# EAGLE design ns (EAGLE 5.09)
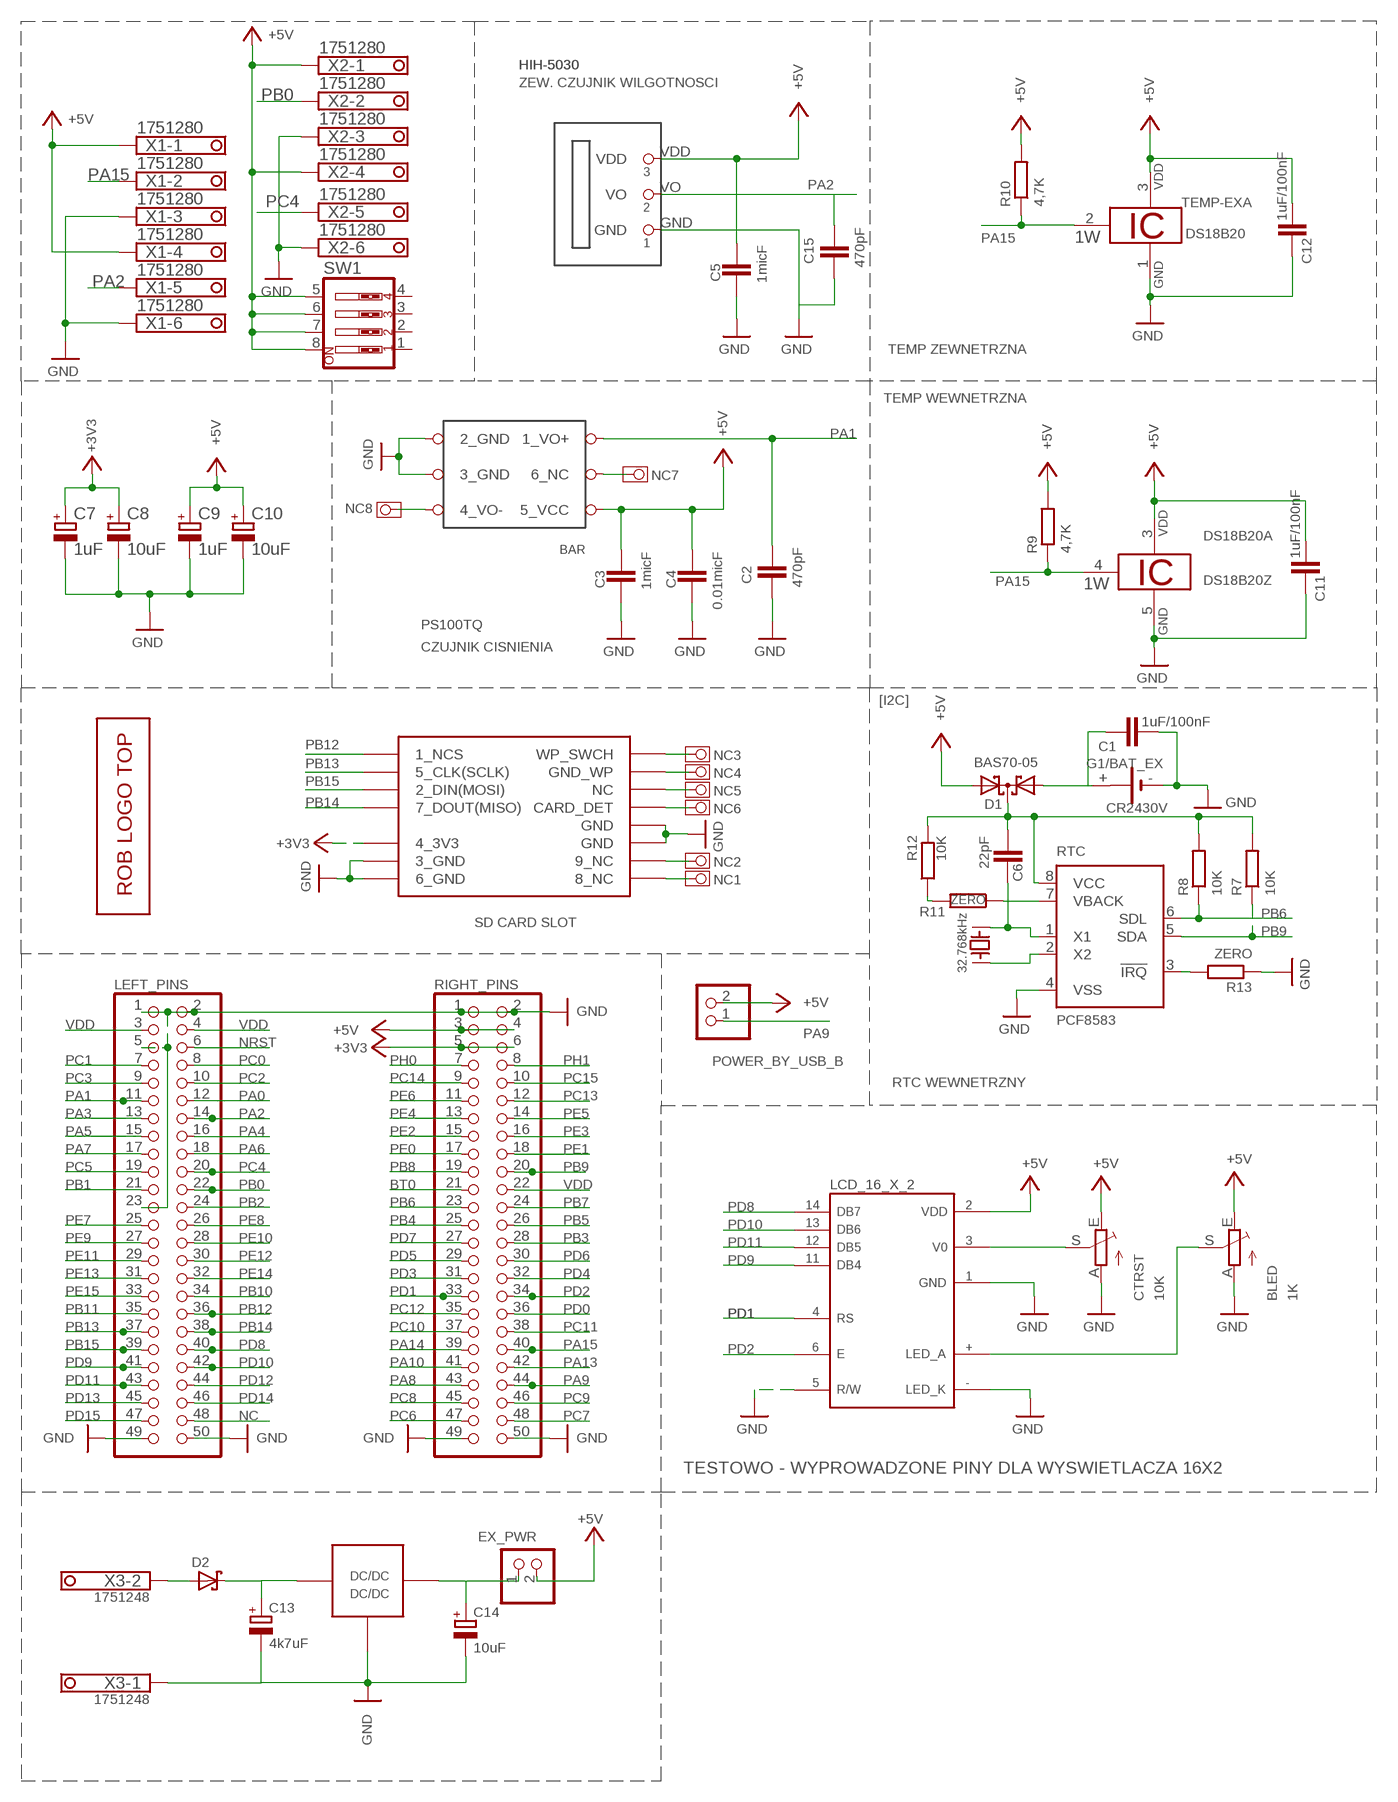
[diagram p0: schematic, sheet 1]

## Parts
BLED  1K  TRIM_EU-B25P  [B25P]
C1  1uF/100nF  C-EUC1206K  [C1206K]
C2  470pF  C-EUC1206K  [C1206K]
C3  1micF  C-EUC1206K  [C1206K]
C4  0.01micF  C-EUC1206K  [C1206K]
C5  1micF  C-EUC1206K  [C1206K]
C6  22pF  C-EUC1206K  [C1206K]
C7  1uF  CPOL-EU153CLV-0505  [153CLV-0505]
C8  10uF  CPOL-EU153CLV-0505  [153CLV-0505]
C9  1uF  CPOL-EU153CLV-0505  [153CLV-0505]
C10  10uF  CPOL-EU153CLV-0505  [153CLV-0505]
C11  1uF/100nF  C-EUC1206K  [C1206K]
C12  1uF/100nF  C-EUC1206K  [C1206K]
C13  4k7uF  CPOL-EU153CLV-0505  [153CLV-0505]
C14  10uF  CPOL-EU153CLV-0505  [153CLV-0505]
C15  470pF  C-EUC1206K  [C1206K]
CTRST  10K  TRIM_EU-B25P  [B25P]
D1  BAS70-05  [SOT23]
D2  MBRS130LT3  [SMB]
DS18B20  DS18B20Z  [SO08]
EX_PWR  PINHD-1X2  [1X02]
G1/BAT_EX  CR2430V  [CR2430V]
LCD_16_X_2  PYC0802A  [PYC0802A-ONLY-PINS]
LEFT_PINS  PINHD-2X25  [2X25]
NC1  SMD_1X1  [SMD_1X1]
NC2  SMD_1X1  [SMD_1X1]
NC3  SMD_1X1  [SMD_1X1]
NC4  SMD_1X1  [SMD_1X1]
NC5  SMD_1X1  [SMD_1X1]
NC6  SMD_1X1  [SMD_1X1]
NC7  SMD_1X1  [SMD_1X1]
NC8  SMD_1X1  [SMD_1X1]
POWER_BY_USB_B  PINHD-1X2  [1X02]
R7  10K  R-EU_M1206  [M1206]
R8  10K  R-EU_M1206  [M1206]
R9  4,7K  R-EU_M1206  [M1206]
R10  4,7K  R-EU_M1206  [M1206]
R11  ZERO  R-EU_R1206  [R1206]
R12  10K  R-EU_R1206  [R1206]
R13  ZERO  R-EU_R1206  [R1206]
RIGHT_PINS  PINHD-2X25  [2X25]
RTC  PCF8583  X1205S8  [SO-08]
SW1  SW_DIP-4  [EDG-04]
TEMP-EX  DS18B20  [TO92-]
U$1  MMC  [MMC_SOCKET]
U$2  XTAL-SMD-MC-146  [XTAL-SMD-MC-146]
U$3  PS100TQ  [PS100TQ]
U$4  HIH5030-CZUJ-WILG  [HIH-5030-CZUJ-WILG]
U$5  ROB-LOGO  [ROB-LOGO-TOP]
U$6  PRZETW-RECOM-R785  [PRZETW-RECOM-R785]
X1  1751280  [1751280]
X2  1751280  [1751280]
X3  1751248  [1751248]

## Nets
32_7_X1: C6.1 RTC.1(X1) U$2.P$3
32_7_X2: RTC.2(X2) U$2.P$1
+3V3: C7.+ C8.+ RIGHT_PINS.5 RIGHT_PINS.6 U$1.4_3V3
+5_RTC: C6.2 D1.3(C) R7.2 R8.2 R12.2 RTC.8(VCC)
+5V: BLED.E C3.2 C4.2 C5.2 C9.+ C10.+ C11.2 C12.2 CTRST.E D1.2(A2) DS18B20.3 EX_PWR.2 LCD_16_X_2.2 POWER_BY_USB_B.2 R9.2 R10.2 RIGHT_PINS.3 RIGHT_PINS.4 SW1.5 SW1.6 SW1.7 SW1.8 TEMP-EX.3 U$3.VCC(5_VCC) U$4.VDD X1.1 X1.4 X2.1 X2.4
BT0: RIGHT_PINS.21
GND: BLED.A C1.2 C2.1 C3.1 C4.1 C5.1 C7.- C8.- C9.- C10.- C11.1 C12.1 C13.- C14.- C15.1 CTRST.A DS18B20.5 G1/BAT_EX.- LCD_16_X_2.1 LCD_16_X_2.5 LCD_16_X_2.LED_K LEFT_PINS.1 LEFT_PINS.2 LEFT_PINS.5 LEFT_PINS.23 LEFT_PINS.49 LEFT_PINS.50 R13.1 RIGHT_PINS.1 RIGHT_PINS.2 RIGHT_PINS.49 RIGHT_PINS.50 RTC.4(VSS) TEMP-EX.1 U$1.3_GND@1(3_GND) U$1.6_GND@2(6_GND) U$1.GND@3(GND) U$1.GND@4(GND) U$3.GND1(2_GND) U$3.GND2(3_GND) U$4.GND U$6.DC_GND X1.3 X1.6 X2.3 X2.6 X3.1
LCD_LED_A: BLED.S LCD_16_X_2.LED_A
LCD_V0: CTRST.S LCD_16_X_2.3
N$1: NC7.P$1 U$3.NC(6_NC)
N$2: NC3.P$1 U$1.WRITE_PROTECTION_SWITCH(WP_SWCH)
N$3: NC8.P$1 U$3.V0-(4_VO-)
N$4: NC4.P$1 U$1.GND@WP(GND_WP)
N$6: NC5.P$1 U$1.NC@3(NC)
N$7: NC6.P$1 U$1.CARD_DETECTION(CARD_DET)
N$8: NC1.P$1 U$1.8_NC@2(8_NC)
N$9: NC2.P$1 U$1.9_NC@1(9_NC)
N$10: C13.+ D2.C U$6.DC_IN
N$11: R11.1 RTC.7(VBACK)
N$12: C1.1 D1.1(A1) G1/BAT_EX.+
N$19: R11.2 R12.1
N$21: C14.+ EX_PWR.1 U$6.DC_OUT
N$22: D2.A X3.2
N$28: R13.2 RTC.3(!IRQ)
NC: LEFT_PINS.48
NRST: LEFT_PINS.6
PA0: LEFT_PINS.12
PA1: C2.2 LEFT_PINS.11 U$3.VO+(1_VO+)
PA2: C15.2 LEFT_PINS.14 U$4.VO X1.5
PA3: LEFT_PINS.13
PA4: LEFT_PINS.16
PA5: LEFT_PINS.15
PA6: LEFT_PINS.18
PA7: LEFT_PINS.17
PA8: RIGHT_PINS.43
PA9: POWER_BY_USB_B.1 RIGHT_PINS.44
PA10: RIGHT_PINS.41
PA13: RIGHT_PINS.42
PA14: RIGHT_PINS.39
PA15: DS18B20.4 R9.1 R10.1 RIGHT_PINS.40 TEMP-EX.2 X1.2
PB0: LEFT_PINS.22 X2.2
PB1: LEFT_PINS.21
PB2: LEFT_PINS.24
PB3: RIGHT_PINS.28
PB4: RIGHT_PINS.25
PB5: RIGHT_PINS.26
PB6: R8.1 RIGHT_PINS.23 RTC.6(SDL)
PB7: RIGHT_PINS.24
PB8: RIGHT_PINS.19
PB9: R7.1 RIGHT_PINS.20 RTC.5(SDA)
PB10: LEFT_PINS.34
PB11: LEFT_PINS.35
PB12: LEFT_PINS.36 U$1.1_NCS
PB13: LEFT_PINS.37 U$1.5_CLK(SCLK)
PB14: LEFT_PINS.38 U$1.7_DOUT(MISO)
PB15: LEFT_PINS.39 U$1.2_DIN(MOSI)
PC0: LEFT_PINS.8
PC1: LEFT_PINS.7
PC2: LEFT_PINS.10
PC3: LEFT_PINS.9
PC4: LEFT_PINS.20 X2.5
PC5: LEFT_PINS.19
PC6: RIGHT_PINS.47
PC7: RIGHT_PINS.48
PC8: RIGHT_PINS.45
PC9: RIGHT_PINS.46
PC10: RIGHT_PINS.37
PC11: RIGHT_PINS.38
PC12: RIGHT_PINS.35
PC13: RIGHT_PINS.12
PC14: RIGHT_PINS.9
PC15: RIGHT_PINS.10
PD0: RIGHT_PINS.36
PD1: LCD_16_X_2.4 RIGHT_PINS.33
PD2: LCD_16_X_2.6 RIGHT_PINS.34
PD3: RIGHT_PINS.31
PD4: RIGHT_PINS.32
PD5: RIGHT_PINS.29
PD6: RIGHT_PINS.30
PD7: RIGHT_PINS.27
PD8: LCD_16_X_2.14 LEFT_PINS.40
PD9: LCD_16_X_2.11 LEFT_PINS.41
PD10: LCD_16_X_2.13 LEFT_PINS.42
PD11: LCD_16_X_2.12 LEFT_PINS.43
PD12: LEFT_PINS.44
PD13: LEFT_PINS.45
PD14: LEFT_PINS.46
PD15: LEFT_PINS.47
PE0: RIGHT_PINS.17
PE1: RIGHT_PINS.18
PE2: RIGHT_PINS.15
PE3: RIGHT_PINS.16
PE4: RIGHT_PINS.13
PE5: RIGHT_PINS.14
PE6: RIGHT_PINS.11
PE7: LEFT_PINS.25
PE8: LEFT_PINS.26
PE9: LEFT_PINS.27
PE10: LEFT_PINS.28
PE11: LEFT_PINS.29
PE12: LEFT_PINS.30
PE13: LEFT_PINS.31
PE14: LEFT_PINS.32
PE15: LEFT_PINS.33
PH0: RIGHT_PINS.7
PH1: RIGHT_PINS.8
VDD: LEFT_PINS.3 LEFT_PINS.4 RIGHT_PINS.22
Unconnected: G1/BAT_EX.+@1(+) SW1.1 SW1.2 SW1.3 SW1.4

## Notes on the sheet
- HIH-5030 | HIH-5030
- ZEW. CZUJNIK WILGOTNOSCI
- TEMP ZEWNETRZNA
- TEMP WEWNETRZNA
- PS100TQ
- CZUJNIK CISNIENIA
- [I2C]
- SD CARD SLOT
- RTC WEWNETRZNY
- TESTOWO - WYPROWADZONE PINY DLA WYSWIETLACZA 16X2

## Library data of the parts
BLED CTRST = pot:TRIM_EU-: POTENTIOMETER
C1-C6 C11 C12 C15 = rcl:C-EU: CAPACITOR, European symbol
C7-C10 C13 C14 = rcl:CPOL-EU: POLARIZED CAPACITOR, European symbol
D1 = diode:BAS70-05: Silicon Schottky Diodes General-purpose diode for high-speed switching
D2 = diode:MBRS130LT3: Schottky Power Rectifier Source: http://www.onsemi.com/pub/Collateral/MBRS130LT3-D.PDF
DS18B20 TEMP-EX = ds18b20:DS18B20: Programmable Resolution Digital Thermometer This chip provides a onewire thermosensor with approx. 0.5°C accuracy. A programmable over/undertemperure alarm is available. The precision can be set from 9..12 bits. Notes: Vdd must be applied for accurate measurements at low temperatures, as the parasite power circuit otherwise heats the sensor. If parasite power is used, Vdd has to be connected to GND. The DS1822 is a low-cost thermometer chip, the DS18S20 is similar to the DS18B20, but with 9 Bit precision only. Author: Jan Kandziora <jjj@gmx.de>
EX_PWR POWER_BY_USB_B = pinhead:PINHD-1X2: PIN HEADER
G1/BAT_EX = battery:CR2430V: LI BATTERY Varta
LCD_16_X_2 = PYC0802:PYC0802A
LEFT_PINS RIGHT_PINS = pinhead:PINHD-2X25: PIN HEADER
NC1-NC8 = pinhead:SMD_1X1
R7-R13 = rcl:R-EU_: RESISTOR, European symbol
RTC = xicor:X1205*: 2-Wire RTC Real Time Clock/Calendar
SW1 = special:SW_DIP-4: DIP SWITCH
U$1 = SD:MMC
U$2 = rob:XTAL-SMD-MC-146
U$3 = rob:PS100TQ
U$4 = rob:HIH5030-CZUJ-WILG
U$5 = rob:ROB-LOGO
U$6 = rob:PRZETW-RECOM-R785
X1 X2 = con-phoenix-350:1751280: MKDS 1/ 6-3,5 Printklemme Nennstrom: 10 A Bemessungsspannung: 160 V Raster: 3,5 mm Polzahl: 6 Montageart: Löten Anschlussart: Schraubanschluss Anschlussrichtung vom Leiter zur Platine: 0° Source: http://eshop.phoenixcontact.com .. 1751280.pdf
X3 = con-phoenix-350:1751248: MKDS 1/ 2-3,5 Printklemme Nennstrom: 10 A Bemessungsspannung: 160 V Raster: 3,5 mm Polzahl: 2 Montageart: Löten Anschlussart: Schraubanschluss Anschlussrichtung vom Leiter zur Platine: 0° Source: http://eshop.phoenixcontact.com .. 1751248.pdf

## Board
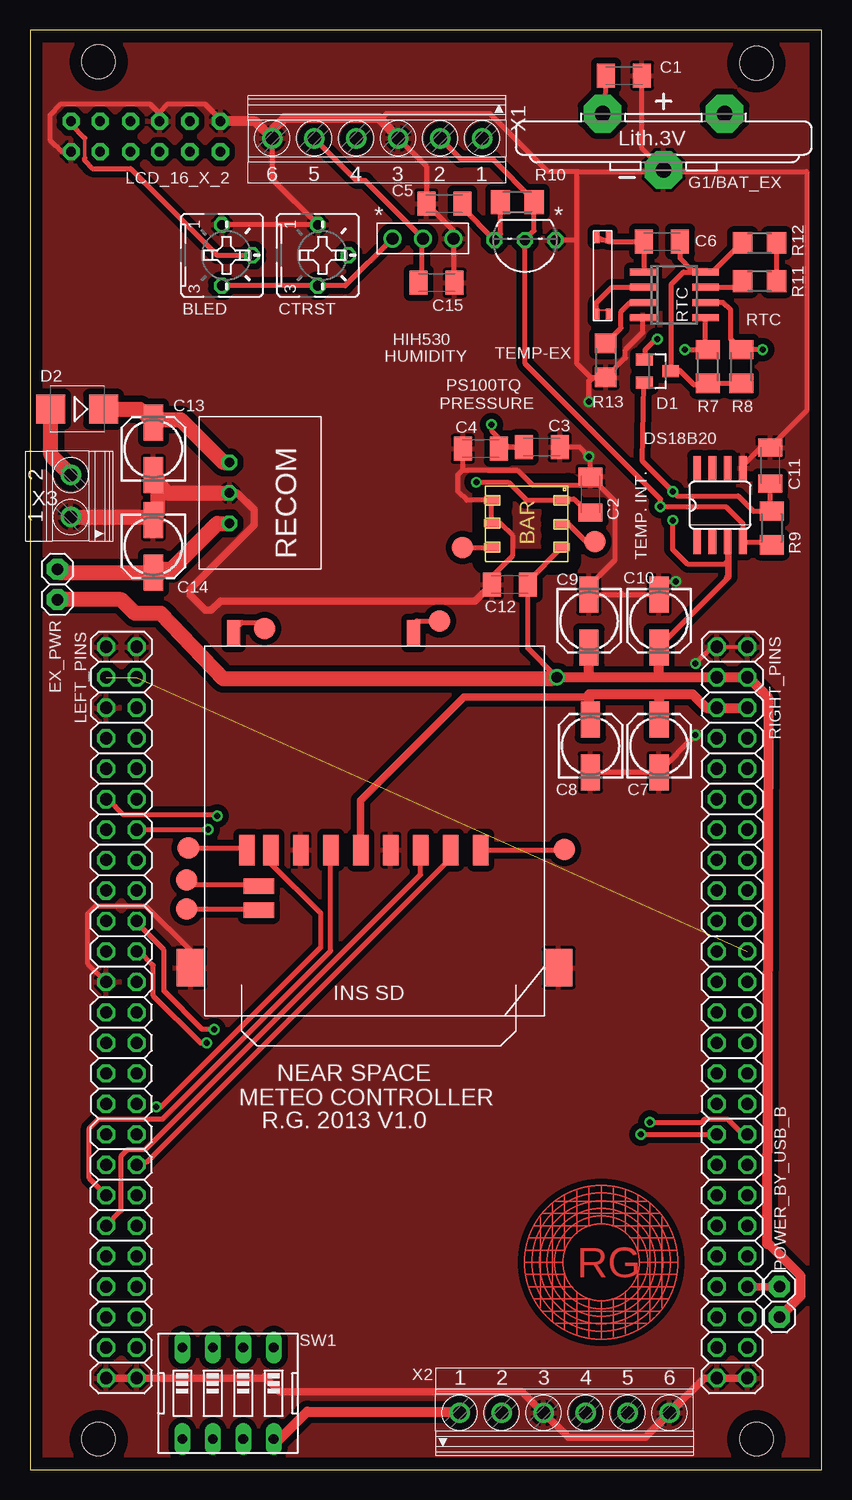
[diagram p1: board, top side]
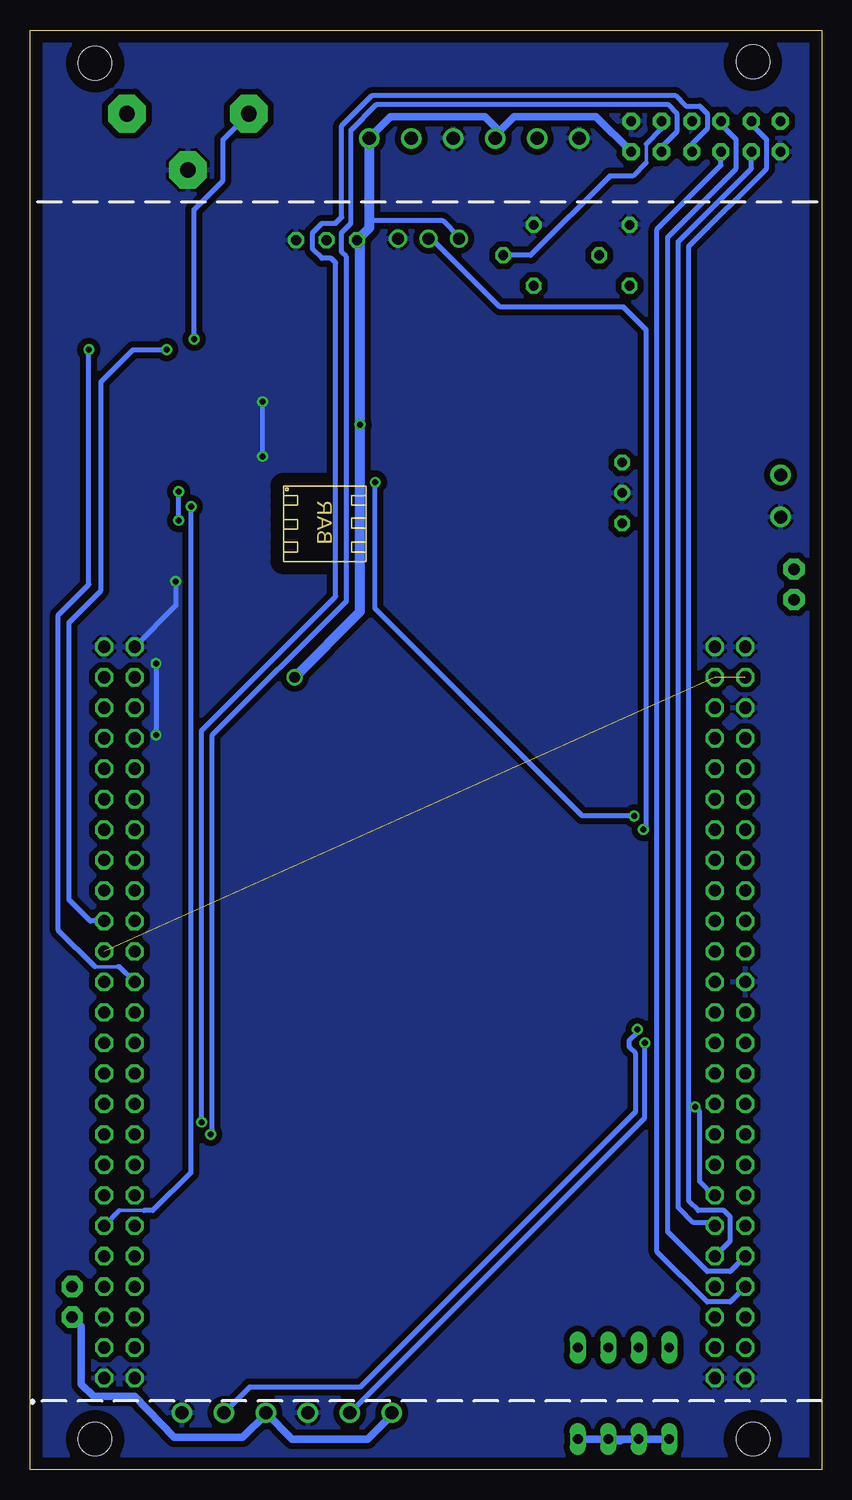
[diagram p2: board, bottom side, seen from below]

Size 66 x 120 mm. Coordinates in mm from the lower left corner, seen from the top.
Outline: 0,0 66,0 66,120 0,120 0,0
Copper layers (1*16): Top 0.035mm / dielectric 1.5mm / Bottom 0.035mm
Design rules "default *": minimum track width 10mil, minimum drill 24mil, track to track 20mil, track to pad 20mil, pad to pad 20mil, via to via 20mil, smd to smd 20mil, copper to edge 40mil, drill to drill 20mil, minimum pad ring 10mil, minimum via ring 8mil, stop-mask expansion 4mil, vias tented up to drill 0mil, thermal gap 10mil
Holes 2.8 mm at 5.71,117.35 60.58,117.22 60.58,2.54 5.71,2.54

### Footprints (pad centres in the part's own frame; a part is rotated, then mirrored left to right if it is on the bottom)
B25P = drill 0.813 octagon: A -2.54,0; E 2.54,0; S 0,2.54
C1206K = smd 1.5 x 2: 1 -1.5,0; 2 1.5,0
153CLV-0505 = smd 3 x 1.6: + 2.2,0; - -2.2,0
SOT23 = smd 1 x 1.4: 1 -0.95,-1.1; 2 0.95,-1.1; 3 0,1.1
SMB = smd 2.4 x 2.4: A 2.2,0; C -2.2,0
SO08 = smd 0.66 x 2.032: 1 -1.905,-3.073; 2 -0.635,-3.073; 3 0.635,-3.073; 4 1.905,-3.073; 5 1.905,3.073; 6 0.635,3.073; 7 -0.635,3.073; 8 -1.905,3.073
1X02 = drill 0.965 pad 1.778 octagon: 1 -1.27,0; 2 1.27,0
CR2430V = drill 1.321 pad 3.15 octagon: + -2.54,-5.08; +@1 -2.54,5.08; - 2.159,0
PYC0802A-ONLY-PINS = drill 0.8 pad 1.422 octagon: 1 2.54,0; 2 0,0; 3 2.54,2.54; 4 0,2.54; 5 2.54,5.08; 6 0,5.08; 11 2.54,7.493; 12 0,7.493; 13 2.54,10.033; 14 0,10.033; LED_A 2.54,12.446; LED_K 0,12.446
2X25 = drill 1.016 octagon: 1 -30.48,-1.27; 2 -30.48,1.27; 3 -27.94,-1.27; 4 -27.94,1.27; 5 -25.4,-1.27; 6 -25.4,1.27; 7 -22.86,-1.27; 8 -22.86,1.27; 9 -20.32,-1.27; 10 -20.32,1.27; 11 -17.78,-1.27; 12 -17.78,1.27; 13 -15.24,-1.27; 14 -15.24,1.27; 15 -12.7,-1.27; 16 -12.7,1.27; 17 -10.16,-1.27; 18 -10.16,1.27; 19 -7.62,-1.27; 20 -7.62,1.27; 21 -5.08,-1.27; 22 -5.08,1.27; 23 -2.54,-1.27; 24 -2.54,1.27; 25 0,-1.27; 26 0,1.27; 27 2.54,-1.27; 28 2.54,1.27; 29 5.08,-1.27; 30 5.08,1.27; 31 7.62,-1.27; 32 7.62,1.27; 33 10.16,-1.27; 34 10.16,1.27; 35 12.7,-1.27; 36 12.7,1.27; 37 15.24,-1.27; 38 15.24,1.27; 39 17.78,-1.27; 40 17.78,1.27; 41 20.32,-1.27; 42 20.32,1.27; 43 22.86,-1.27; 44 22.86,1.27; 45 25.4,-1.27; 46 25.4,1.27; 47 27.94,-1.27; 48 27.94,1.27; 49 30.48,-1.27; 50 30.48,1.27
SMD_1X1 = smd 1.778 x 1.778: P$1 0,0
M1206 = smd 1.6 x 2: 1 -1.4,0; 2 1.4,0
R1206 = smd 1.6 x 1.803: 1 -1.422,0; 2 1.422,0
SO-08 = smd 0.6 x 2.2: 1 -1.905,-2.6; 2 -0.635,-2.6; 3 0.635,-2.6; 4 1.905,-2.6; 5 1.905,2.6; 6 0.635,2.6; 7 -0.635,2.6; 8 -1.905,2.6
EDG-04 = drill 0.813 long: 1 -3.81,-3.81; 2 -1.27,-3.81; 3 1.27,-3.81; 4 3.81,-3.81; 5 3.81,3.81; 6 1.27,3.81; 7 -1.27,3.81; 8 -3.81,3.81
TO92- = drill 0.813 octagon: 1 -2.54,0; 2 0,0; 3 2.54,0
MMC_SOCKET = smd 1.27 x 2.54: 1_NCS 7.27,-2.73; 2_DIN(MOSI) 4.77,-2.73; 3_GND@1 2.27,-2.73; 4_3V3 -0.23,-2.73; 5_CLK(SCLK) -2.73,-2.73; 6_GND@2 -5.23,-2.73; 7_DOUT(MISO) -7.73,-2.73; 8_NC@2 -9.73,-2.73; 9_NC@1 9.77,-2.73 | smd 1.067 x 2.184: CARD_DETECTION -10.83,15.37; NC@3 4.17,15.37 | smd 2.3 x 3.1: GND@3 -14.43,-12.53; GND@4 16.27,-12.53 | smd 2.54 x 1.27: GND@WP -8.73,-5.73; WRITE_PROTECTION_SWITCH -8.73,-7.73
XTAL-SMD-MC-146 = smd 1.016 x 0.508: P$1 0.508,1.27; P$2 0.508,0.254; P$3 6.985,1.27; P$4 6.985,0.254
PS100TQ = smd 1.27 x 0.66: GND1 0.5,5.1; GND2 0.5,3.2; NC 6.4,3.1; V0- 0.5,1.2; VCC 6.4,1.2; VO+ 6.4,5.1
HIH-5030-CZUJ-WILG = drill 1 pad 1.27 round: GND 1.27,0; VDD -3.81,0; VO -1.27,0
PRZETW-RECOM-R785 = drill 0.8 octagon: DC_GND 2.54,0; DC_IN 0,0; DC_OUT 5.08,0
1751280 = drill 1.1 pad 1.7 round: 1 -8.75,-0.1; 2 -5.25,-0.1; 3 -1.75,-0.1; 4 1.75,-0.1; 5 5.25,-0.1; 6 8.75,-0.1
1751248 = drill 1.1 pad 1.7 round: 1 -1.75,-0.1; 2 1.75,-0.1

### Placement (x,y rotation side)
BLED  16,101.22 270 top
C1  49.53,116.2 0 top
C2  46.74,81.28 270 top
C3  42.67,85.22 180 top
C4  37.59,85.09 0 top
C5  34.54,105.54 0 top
C6  52.7,102.36 0 top
C7  52.45,60.33 90 top
C8  46.74,60.33 90 top
C9  46.61,70.74 270 top
C10  52.45,70.74 270 top
C11  61.72,83.69 270 top
C12  40.01,73.79 0 top
C13  10.29,85.09 90 top
C14  10.29,76.96 270 top
C15  33.91,98.93 180 top
CTRST  24,101.22 270 top
D1  52.32,91.57 270 top
D2  3.94,88.39 180 top
DS18B20  57.53,80.39 0 top
EX_PWR  2.29,73.79 270 top
G1/BAT_EX  52.83,110.49 270 top
LCD_16_X_2  15.88,109.86 90 top
LEFT_PINS  7.62,38.1 270 top
NC1  13.21,51.82 0 top
NC2  44.58,51.69 0 top
NC3  13.08,46.74 0 top
NC4  13.08,49.15 0 top
NC5  34.16,70.74 0 top
NC6  19.56,70.1 0 top
NC7  47.12,77.34 0 top
NC8  36.07,76.83 0 top
POWER_BY_USB_B  62.48,13.97 270 top
R7  56.52,91.95 270 top
R8  59.31,91.95 270 top
R9  61.85,78.49 90 top
R10  40.64,105.66 180 top
R11  60.83,99.06 0 top
R12  60.83,102.23 180 top
R13  48.01,92.46 90 top
RIGHT_PINS  58.55,38.1 270 top
RTC  53.72,97.92 270 top
SW1  16.51,6.35 180 top
TEMP-EX  41.27,102.49 180 top
U$1  27.81,54.36 0 top
U$2  48.51,95.76 90 top
U$3  37.97,75.69 0 top
U$4  34.04,102.62 0 top
U$5  47.62,17.27 0 top
U$6  16.64,83.95 270 top
X1  28.96,110.87 180 top
X2  44.58,4.83 0 top
X3  3.3,81.15 90 top

### Tracks (layer width: path | path; a pad name or v marks a point on that pad's centre or on a via)
32_7_X1
  Top 0.406: RTC.1 51.2,99.91 C6.1 48.26,102.36 U$2.P$3
32_7_X2
  Top 0.406: RTC.2 48.51,98.55 47.24,97.28 U$2.P$1
+3V3
  Top 0.61: U$1.4_3V3 27.58,55.78 36.2,64.39 46.35,64.39 46.61,64.64
  Top 0.813: RIGHT_PINS.6 RIGHT_PINS.5 56.39,63.5 55.24,64.64 52.45,64.64 | 52.45,64.64 C7.+ | 52.45,64.64 46.61,64.64 46.61,62.65 C8.+
+5_RTC
  Top 0.406: RTC.8 56.52,99.82 | R12.2 59.31,102.23 57.02,99.95 56.45,99.95 | RTC.8 56.45,99.95 | 56.45,99.95 55.24,99.95 54.23,100.97 54.23,102.34 C6.2 | RTC.8 54.48,99.82 53.47,98.81 53.47,91.61 | 53.47,91.61 D1.3 | 53.47,91.61 54.19,91.61 55.37,90.42 56.39,90.42 R7.2 R8.2
+5V  (via drill 0.5 pad 0.41, 0.9 pad 0.41)
  Top 0.406: R10.2 39.24,102.99 TEMP-EX.3 36.04,105.18 C5.2 | v43.94,66.04 41.51,68.48 C12.2 41.51,74.02 U$3.VCC | C11.2 61.72,80.01 R9.2 60.32,79.89 59.05,81.15 53.98,81.15 v53.59,81.53 53.53,81.6 53.47,81.66 51.05,84.07 51.18,90.57 | 51.18,90.57 51.05,90.45 | C10.+ 52.45,68.58 58.29,74.42 58.29,77.19 DS18B20.3 58.17,75.69 | 51.18,90.57 D1.2 | 58.17,75.69 58.17,74.42 58.04,74.3 | v53.59,79.12 53.59,76.71 54.86,75.44 57.91,75.44 58.17,75.69 | BLED.E CTRST.E 26.29,98.68 U$4.VDD | C4.2 39.22,85.22 C3.2 39.88,85.22 38.48,86.61 v38.48,87.12
  Top 0.813: 46.86,66.04 v43.94,66.04 | 52.45,66.04 46.86,66.04 | 52.45,66.04 RIGHT_PINS.3 RIGHT_PINS.4 59.94,66.04 61.59,64.26 61.47,18.8 61.59,18.8 64.26,16.13 64.26,14.48 POWER_BY_USB_B.2 | 52.45,66.04 C10.+ | C9.+ 46.61,66.29 46.86,66.04 | SW1.8 20.83,2.54 23.11,4.83 35.73,4.83 X2.1
  Top 1.27: EX_PWR.2 7.62,72.52 8.76,71.37 10.92,71.37 16.13,65.91 43.43,65.91 v43.94,66.04
  Bottom 0.406: v53.59,79.12 v53.59,81.53 | U$4.VDD 30.23,102.74 31.62,104.14 37.58,104.14 37.71,103.76
  Bottom 0.61: 37.71,111.01 35.94,112.78 28.07,112.78 27.18,111.89 27.18,111 | X1.4 27.21,111.22 25.65,112.78 18.8,112.78 LCD_16_X_2.2 | X2.1 35.83,4.56 37.85,2.54 44.14,2.54 X2.4 46.33,4.6 48.26,2.67 53.98,2.67 57.28,6.1 60.71,6.1 61.72,7.11 61.72,11.94 POWER_BY_USB_B.2 | SW1.7 SW1.8 | SW1.7 16.89,2.54 16.76,2.41 17.65,2.41 SW1.7 | SW1.7 SW1.6 SW1.5
  Bottom 0.813: v43.94,66.04 38.48,71.5 v38.48,87.12 38.48,101.98 38.73,102.11 TEMP-EX.3 37.71,103.52 37.71,103.76 X1.1 37.71,111.01 | 27.18,111 X1.4
GND  (via drill 0.5 pad 0.41)
  Top 0.305: RIGHT_PINS.1 RIGHT_PINS.2 | 52.92,72.94 52.92,73.83 52.7,74.04
  Top 0.406: C1.2 51.03,110.13 G1/BAT_EX.- 52.96,108.2 | DS18B20.5 59.46,83.46 59.46,83.72 61.09,85.34 61.57,85.34 C11.1 61.47,85.45 61.47,85.47 61.98,85.47 64.77,88.27 64.77,108.2 52.96,108.2 | 45.72,108.2 52.96,108.2 | RTC.4 51.12,94.81 49.66,93.34 49.66,92.69 R13.1 46.97,91.03 | 46.97,91.03 46.76,91.03 45.59,92.2 45.59,102.36 | 45.59,102.36 45.59,102.49 | 45.59,102.36 45.47,102.49 TEMP-EX.1 45.59,102.49 | 52.92,72.94 C10.- 49.4,72.94 | 49.4,72.94 C9.- 46.61,73.66 48.77,75.82 48.77,80.75 C2.1 | C12.1 38.51,74.45 40.26,76.2 40.26,77.85 39.24,78.87 38.5,78.87 U$3.GND2 U$3.GND1 36.43,80.79 35.69,81.53 35.69,82.93 36.07,83.31 | 49.4,72.94 49.28,73.07 | C8.- C7.- 52.45,58.17 v55.5,61.21 | 36.07,83.31 40.64,83.31 41.91,82.04 47.4,82.04 C2.1 | 52.7,74.04 v53.85,74.04 | C2.1 46.74,84.45 v46.61,84.45 45.85,85.22 C3.1 | v46.61,89 46.61,90.68 | 46.61,90.68 46.61,90.81 | 46.61,90.68 46.97,91.03 | RIGHT_PINS.1 56.9,68.58 v55.5,67.18 | X1.3 33.04,108.63 C5.1 35.31,103.28 U$4.GND 35.31,99.04 C15.1 | 45.59,102.49 45.59,108.08 45.72,108.2 | 45.72,108.2 43.18,108.2 38.35,113.03 29.72,113.03 29.21,112.52 | LCD_16_X_2.1 15.88,112.52 14.61,113.79 11.43,113.79 10.79,113.16 LCD_16_X_2.5 10.79,113.03 10.03,113.79 2.54,113.79 1.65,112.9 1.65,110.87 2.67,109.86 LCD_16_X_2.LED_K | X1.6 20.21,107.56 CTRST.A BLED.A | LEFT_PINS.49 19.43,7.62 19.56,7.75 | C4.1 36.09,83.34 36.07,83.31 | U$1.GND@3 13.38,43.26 9.65,46.99 5.46,46.99 4.83,46.35 4.83,42.16 LEFT_PINS.23
  Top 0.61: RIGHT_PINS.50 RIGHT_PINS.49 56.22,7.62 X2.6 53.33,4.69 51.31,2.67 44.89,2.67 X2.3 42.83,4.67 | U$6.DC_GND 17.27,81.41 18.67,80.01 18.67,78.74 13.34,73.41 13.34,72.9 14.61,71.63 15.11,71.63 15.88,72.39 37.11,72.39 C12.1 | C14.- 10.29,79.38 10.31,79.4 | 19.56,7.62 LEFT_PINS.50 LEFT_PINS.49 | 42.83,4.67 42.83,4.47 | 42.83,4.67 41.02,6.48 20.83,6.48 19.56,7.75
  Top 0.813: X1.3 30.71,111.03 29.21,112.52 29.08,112.65 21.21,112.65 20.19,111.63 20.19,110.98 X1.6 18.78,112.39 LCD_16_X_2.1
  Top 1.27: X3.1 10.31,79.4 10.67,79.76 10.67,82.17 | 10.67,82.17 10.67,82.51 C13.- | U$6.DC_GND 11.43,81.41 10.67,82.17
  Bottom 0.406: v53.85,74.04 53.85,72.01 RIGHT_PINS.1 | v46.61,84.45 v46.61,89 | v55.5,67.18 v55.5,61.21
  pour Top: -0.13,-0.13 66.04,-0.13 66.04,119.89 65.91,120.02 -0.13,120.02
  pour Bottom: 0,120.02 0,0 66.04,0 66.04,120.02
LCD_LED_A
  Top 0.305: 4.57,109.35 4.57,111
  Top 0.406: LCD_16_X_2.LED_A 3.43,112.14 4.57,111 | 4.57,109.35 4.57,109.09 5.21,108.46 8.38,108.46 15.62,101.22 BLED.S
LCD_V0
  Bottom 0.305: 14.61,108.97 14.61,110.49
  Bottom 0.406: LCD_16_X_2.3 13.34,111.76 14.61,110.49 | 14.61,108.97 15.75,107.82 17.65,107.82 24.26,101.22 CTRST.S
N$1
  Top 0.406: U$3.NC 44.91,78.79 46.61,77.09 NC7.P$1
N$2
  Top 0.406: NC3.P$1 18.97,46.74 U$1.WRITE_PROTECTION_SWITCH
N$3
  Top 0.406: NC8.P$1 38.42,76.83 U$3.V0-
N$4
  Top 0.406: NC4.P$1 13.46,49.15 13.84,48.77 18.94,48.77 U$1.GND@WP
N$6
  Top 0.406: NC5.P$1 32.26,70.74 31.88,70.36 31.88,69.83 U$1.NC@3
N$7
  Top 0.406: U$1.CARD_DETECTION 16.98,69.94 17.65,70.61 19.05,70.61 NC6.P$1
N$8
  Top 0.406: NC1.P$1 17.89,51.82 U$1.8_NC@2
N$9
  Top 0.406: U$1.9_NC@1 44.51,51.63 NC2.P$1
N$10
  Top 1.27: U$6.DC_IN 16.13,83.95 12.57,87.5 10.5,87.5 C13.+ 9.19,88.39 D2.C
N$11
  Top 0.406: RTC.7 58.9,98.55 R11.1
N$12  (via drill 0.5 pad 0.41)
  Top 0.406: C1.1 47.98,113.26 G1/BAT_EX.+ | D1.1 51.22,92.54 51.31,92.71 51.31,93.34 52.2,94.23 v52.32,94.23
  Bottom 0.406: v52.32,94.23 52.32,105.03 49.91,107.44 49.91,110.87 G1/BAT_EX.+
N$19
  Top 0.406: R11.2 R12.1
N$21
  Top 1.27: U$6.DC_OUT 15.62,78.87 11.81,75.06 10.58,75.06 C14.+ 2.58,74.76 EX_PWR.1
N$22
  Top 1.27: D2.A 1.74,84.57 X3.2
N$28
  Top 0.406: RTC.3 50.04,97.28 49.28,96.52 49.28,95.15 R13.2
PA1  (via drill 0.5 pad 0.41)
  Top 0.406: C2.2 46.46,79.78 45.34,80.9 44.48,80.9 U$3.VO+ 41.38,80.79 39.88,82.3 v37.21,82.3 | LEFT_PINS.11 6.48,55.88 7.75,54.61 15.49,54.61 v15.62,54.48
  Bottom 0.406: v37.21,82.3 37.21,71.75 19.94,54.48 v15.62,54.48
PA2  (via drill 0.5 pad 0.41)
  Top 0.406: X1.5 27.23,107.44 27.94,107.44 U$4.VO 32.66,102.26 32.64,99.57 32.64,99.69 32.41,99.34 C15.2 | LEFT_PINS.14 v14.86,53.34
  Bottom 0.406: U$4.VO 32.51,102.62 26.8,96.9 16.51,96.9 14.61,95 14.61,53.47 v14.86,53.34
PA9
  Top 0.61: RIGHT_PINS.44 POWER_BY_USB_B.1
PA15  (via drill 0.5 pad 0.41)
  Top 0.406: R9.1 61.62,77.32 DS18B20.4 59.44,78.87 58.04,80.26 v52.58,80.26 52.58,80.9 52.45,81.03 41.27,92.2 TEMP-EX.2 42.04,103.25 R10.1 42.04,105.79 38.61,109.22 35.96,109.22 X1.2
  Bottom 0.305: 56.52,21.59 58.55,21.59
  Bottom 0.406: 58.55,21.59 RIGHT_PINS.40 | 56.52,21.59 55.75,21.59 52.58,24.77 v52.58,80.26
PB0  (via drill 0.5 pad 0.41)
  Top 0.406: LEFT_PINS.22 9.14,43.18 10.29,42.04 10.29,39.5 14.22,35.56 v14.73,35.56
  Bottom 0.406: v14.73,35.56 14.73,29.32 X2.2
PB6  (via drill 0.5 pad 0.41)
  Top 0.406: RTC.6 57.78,97.28 58.42,96.65 58.42,94.24 R8.1 v61.08,93.35 v61.09,93.34
  Bottom 0.305: 58.67,41.91 60.58,41.91
  Bottom 0.406: v61.09,93.34 61.09,73.79 63.63,71.25 63.63,44.96 60.58,41.91 | 58.67,41.91 58.55,41.91 RIGHT_PINS.23
PB9  (via drill 0.5 pad 0.41)
  Top 0.406: RTC.5 56.32,93.54 R7.1 54.49,93.35 v54.61,93.34
  Bottom 0.406: 54.61,93.47 v54.61,93.34 57.4,93.34 60.07,90.68 60.07,73.28 62.74,70.61 62.74,47.5 60.96,45.72 RIGHT_PINS.20
PB12
  Top 0.406: U$1.1_NCS 35.08,50.96 9.78,25.65 9.14,25.65 LEFT_PINS.36
PB13
  Top 0.406: U$1.5_CLK(SCLK) 25.08,43.24 11.05,29.21 5.71,29.21 4.95,28.45 4.95,24.26 LEFT_PINS.37
PB14  (via drill 0.5 pad 0.41)
  Top 0.406: U$1.7_DOUT(MISO) 20.08,50.53 24.26,46.35 24.26,43.56 10.92,30.23 v10.54,30.23
  Bottom 0.406: LEFT_PINS.38 9.02,22.86 10.16,24 10.16,29.84 v10.54,30.23
PB15
  Top 0.406: U$1.2_DIN(MOSI) 32.58,49.6 9.65,26.67 8.13,26.67 7.62,26.16 7.62,21.59 LEFT_PINS.39
PC4  (via drill 0.5 pad 0.41)
  Top 0.406: LEFT_PINS.20 8.89,45.59 11.18,43.31 11.18,39.88 14.35,36.7 v15.37,36.7
  Bottom 0.406: v15.37,36.7 15.37,36.45 16,35.81 16,35.18 15.49,34.67 15.49,29.84 38.48,6.86 47.7,6.86 X2.5
PD1  (via drill 0.5 pad 0.41)
  Top 0.406: v50.93,27.94 RIGHT_PINS.33
  Bottom 0.406: LCD_16_X_2.4 13.34,110.24 12.06,111.51 12.06,113.03 12.83,113.79 37.08,113.79 39.24,111.63 39.24,103.89 40.01,103.12 40.01,101.47 39.62,101.09 39.62,72.39 50.8,61.21 50.8,28.07 v50.93,27.94
PD2  (via drill 0.5 pad 0.41)
  Top 0.406: RIGHT_PINS.34 59.44,27.94 58.17,29.21 56.26,29.21 56.01,28.96 v51.69,28.96
  Bottom 0.406: LCD_16_X_2.6 10.79,110.49 9.53,111.76 9.53,113.03 10.16,113.67 11.3,113.67 12.19,114.55 37.47,114.55 40.01,112.01 40.01,104.39 40.51,103.89 41.66,103.89 42.42,103.12 42.42,101.73 41.66,100.97 40.89,100.97 40.51,100.58 40.51,72.77 51.69,61.59 v51.69,28.96
PD8
  Bottom 0.406: LCD_16_X_2.14 5.84,108.46 11.94,102.36 11.94,21.84 10.67,20.57 9.14,20.57 LEFT_PINS.40
PD9
  Bottom 0.406: LCD_16_X_2.11 8.38,112.14 7.11,110.87 7.11,108.46 12.83,102.74 12.83,19.81 9.53,16.51 7.62,16.51 LEFT_PINS.41
PD10
  Bottom 0.406: LCD_16_X_2.13 5.84,112.14 4.57,110.87 4.57,108.46 11.05,101.98 11.05,22.35 10.29,21.59 8.13,21.59 7.62,21.08 7.62,19.05 LEFT_PINS.42
PD11
  Bottom 0.406: LCD_16_X_2.12 8.38,108.71 13.72,103.38 13.72,18.16 9.53,13.97 7.62,13.97 LEFT_PINS.43
VDD  (2 unrouted)

### Text on the board
tPlace: * | * | RTC | HIH530 | HUMIDITY | PS100TQ | PRESSURE | TEMP. INT. | NEAR SPACE | METEO CONTROLLER | R.G. 2013 V1.0
tOrigins: HUM | TEMP | [G1] | [A1] | [V1] | [G2] | [A2] | [V2] | [V3] | [A3] | [G3] | [V4] | [A4] | [G4]